# Altium schematic sheet Power.SchDoc
size A4
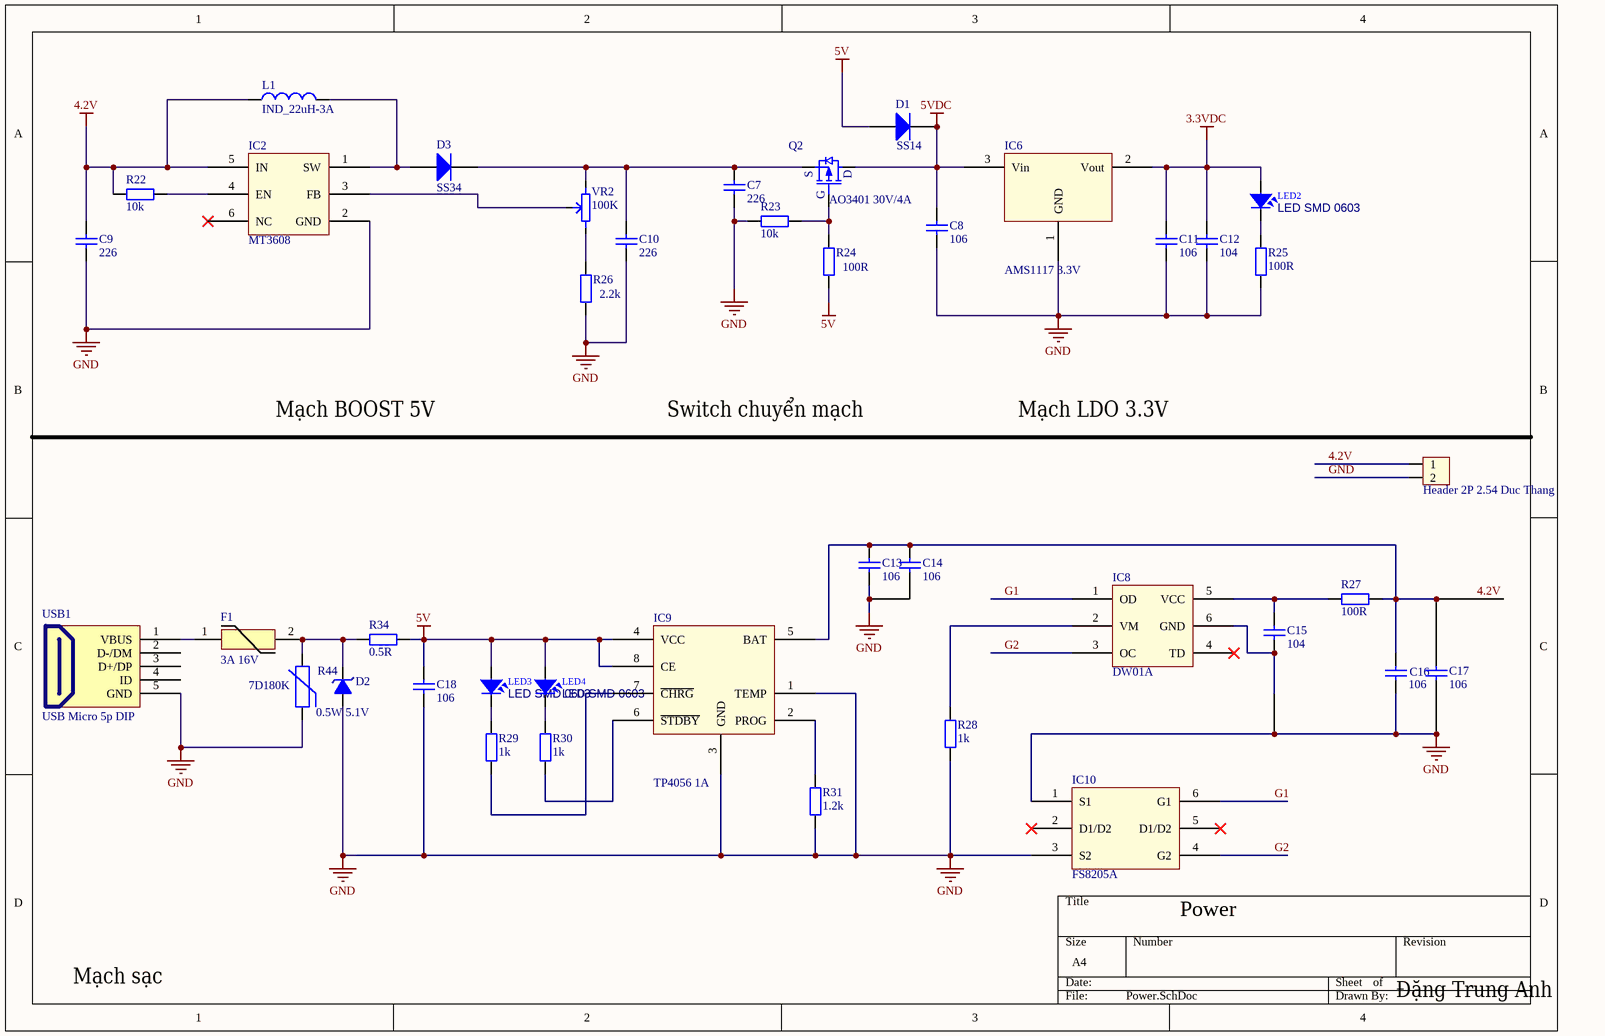
[diagram p0: Power.SchDoc]

## Parts
C7  226  [tu 0603]
C8  106  [tu 0603]
C9  226  [tu 0603]
C10  226  [tu 0603]
C11  106  [tu 0603]
C12  104  [tu 0603]
C13  106  [tu 0603]
C14  106  [tu 0603]
C15  104  [tu 0603]
C16  106  [tu 0603]
C17  106  [tu 0603]
C18  106  [tu 0603]
D1  SS14  [DIODE SMA]
D2  0.5W 5.1V  [DIODE ZENNER SMD SOD80]
D3  SS34  [DIODE SMA]
F1  3A 16V  [FUSE-RUEF250U-2]
H1  Header 2P 2.54 Duc Thang  [XH2.54M-2]
IC2  MT3608  [SOT23-6A]
IC6  AMS1117 3.3V  [SOT223]
IC8  DW01A  [SOT23127P600-8N]
IC9  TP4056 1A  [SOP8]
IC10  FS8205A  [SOT-23-6L]
L1  IND_22uH-3A  [IND_22_10X10_SMD]
LED2  LED SMD 0603  [LED-0603-RED]
LED3  LED SMD 0603  [LED-0603-RED]
LED4  LED SMD 0603  [LED-0603-BLUE]
Q2  AO3401 30V/4A  [SOT23_3]
R22  10k  [tro smd 0603]
R23  10k  [tro smd 0603]
R24  100R  [tro smd 0603]
R25  100R  [tro smd 0603]
R26  2.2k  [tro smd 0603]
R27  100R  [tro smd 0603]
R28  1k  [tro smd 0603]
R29  1k  [tro smd 0603]
R30  1k  [tro smd 0603]
R31  1.2k  [tro smd 0603]
R34  0.5R  [tro smd 0805]
R44  7D180K  [VARISTOR-7D180K]
USB1  USB Micro 5p DIP  [USB Micro 5p DIP]
VR2  100K  [Bien Tro Tam Giac Dung]

## Nets
3.3VDC: C11.1 C12.1 IC6.2(Vout) LED2.A
4.2V: C9.1 C13.1 C14.1 C16.1 C17.1 H1.1 IC2.5(IN) IC9.5(BAT) L1.1 R22.1 R27.1
5V: C18.1 D1.1(A) IC9.4(VCC) IC9.8(CE) LED3.A LED4.A R24.1 R34.2
5VDC: C8.1 D1.2(K) IC6.3(Vin) Q2.3(D)
GND: C7.2 C8.2 C9.2 C10.2 C11.2 C12.2 C13.2 C14.2 C15.2 C16.2 C17.2 C18.2 D2.1(A) H1.2 IC2.2(GND) IC6.1(GND) IC8.6(GND) IC9.1(TEMP) IC9.3(GND) IC10.1(S1) IC10.3(S2) R23.1 R25.1 R26.1 R28.1 R31.1 R44.1 USB1.5(GND)
G1: IC8.1(OD) IC10.6(G1)
G2: IC8.3(OC) IC10.4(G2)
NetC7_1: C7.1 C10.1 D3.2(K) Q2.2(S) VR2.3
NetC15_1: C15.1 IC8.5(VCC) R27.2
NetD2_2: D2.2(K) F1.2 R34.1 R44.2
NetD3_1: D3.1(A) IC2.1(SW) L1.2
NetF1_1: F1.1 USB1.1(VBUS)
NetIC2_3: IC2.3(FB) VR2.2
NetIC2_4: IC2.4(EN) R22.2
NetIC8_2: IC8.2(VM) R28.2
NetIC9_2: IC9.2(PROG) R31.2
NetIC9_6: IC9.6(~{STDBY}) R30.1
NetIC9_7: IC9.7(~{CHRG}) R29.1
NetLED2_K: LED2.K R25.2
NetLED3_K: LED3.K R29.2
NetLED4_K: LED4.K R30.2
NetQ2_1: Q2.1(G) R23.2 R24.2
NetR26_2: R26.2 VR2.1

Not connected (* = marked no-connect by the designer): IC2 6(NC)*; IC8 4(TD)*; IC10 2(D1/D2)* 5(D1/D2)*; USB1 2(D-/DM) 3(D+/DP) 4(ID)

## Notes on the sheet
- Mạch BOOST 5V
- Switch chuyển mạch
- Mạch LDO 3.3V
- (near IC10) Power
- Mạch sạc
- Đặng Trung Anh

## Library data of the parts
C7 C9 C10 = Tu 0603 226 6.3V 10%: Dán; Don_Vi: Con; So_Chan: 2; Ten_Linh_Kien: Tụ 0603 101-0.1nF 10% 50V; Ma_Hang: MH004565; Chung_Loai: Dán; Kieu_Chan: *
C8 C11 C13 C14 C16-C18 = Tu 0603 106 16V 20%: Dán; Don_Vi: Con; So_Chan: 2; Ten_Linh_Kien: Tụ 0603-10uF 20% 16V; Ma_Hang: MH004848; Chung_Loai: Dán; Kieu_Chan: *
C12 C15 = Tu 0603 104 50V 10%: Dán; Don_Vi: Con; So_Chan: 2; Ten_Linh_Kien: Tụ 0603 104-100nF 10% 50V; Ma_Hang: MH004568; Chung_Loai: Dán; Kieu_Chan: *
D1 = Diode SS14 ( 1N5819): Dán; Ma_Hang: MH002211; Don_Vi: Con; Ten_Linh_Kien: Diode SS14 DO214 Schottky 1A 40V ( 1N5819 DO214); Chung_Loai: Dán; Ghi_Chu: *; Kieu_Chan: *
D2 = Diode Zener 5.1V: Dán; Ma_Hang: MH002881; Ten_Linh_Kien: Diode Zener 1/2W 5.1V SMD1206 ZMM5.1; Don_Vi: Con; Kieu_Chan: *; Ghi_Chu: *; Chung_Loai: Dán
D3 = Diode SS34 ( 1N5822 ): Dán; Don_Vi: Con; Ma_Hang: MH002104; Ten_Linh_Kien: Diode SS34 3A 40V SMA ( 1N5822 SS34A); Kieu_Chan: *; Chung_Loai: Dán
F1 = Cau chi tu phuc hoi 3A 16V: FUSE POLYSWITCH RUE SERIES 3A 16V; MPN: RUEF250U-2; CompanyID: VT-00891; Solder: WAVE; Value: 30V/2.5A
H1 = Header 2P 2.54 Duc Thang: Cắm; Ten_Linh_Kien: Header 2P XH2.54-2P Đực Thẳng; Don_Vi: Con; Ma_Hang: MH001283; Chung_Loai: Cắm
IC2 = MT3608_Boost
L1 = IND_22uH-3A-30%-SMD_1: Fixed Inductors MSS1038 SMT Shielded 15 uH 20 % 3.8 A; Manufacturer: Bourns; Manufacturer Part Number: MSS1038-153MLC; Alternate Part Number-1: NA; Case/Package: SMD; Supplier-1: COILCRAFT SAMPLE; Supplier Part Number-1: MSS1038-153MLC
LED2-LED4 = LED SMD 0603: LED 0603 SMD Green 525nm 350mcd 20mA; Manufacturer 1: Kingbright; Manufacturer Part Number 1: APT1608ZGCK; Material: InGaN; Ratings: 200mcd min; 350 mcd typ @ 20mA; Voltage - Forward (Vf) @ 10mA: 3.1V; Viewing Angle: 120°; Lens Style/Size: Rectangle with Flat Top, 1.2mm x 0.8mm; Voltage - Forward (Vf) @ 20mA: 3.3V; SCDType: source; Package / Case: 0603 (1608 metric); Color: Green; Current - Test: 20mA; Manufacturer 2: Kingbright Company LLC; Manufacturer Part Number 2: APT1608-WAP24; Supplier 1: Mouser; Supplier Part Number 1: 604-APT1608ZGCK; ComponentLink1URL: http://www.mouser.com/ds/2/216/APT1608ZGCK-262051.pdf; ComponentLink1Description: http://www.mouser.com/ds/2/216/APT1608ZGCK-262051.pdf; ComponentLink2Description: APT1608-WAP24 Datasheet; ComponentLink2URL: \\SVFI2\PBLShare\Eng\Electrical Engineering\Hardware\Altium\Libraries and Templates\Unreleased Components\Part Number Request 2013-10-02\APT1608-WAP24(Ver.1B).pdf
Q2 = AO3401: MOSFET P-CH 30V 4A SOT23; MPN: AO3415; MFR: Alpha & Omega Semiconductor Inc.; Value: 20V/4A; Solder: SMT
R22 R23 = Tro 0603 5% 10k: Dán; Don_Vi: Con; So_Chan: 2; Ten_Linh_Kien: Trở 0603 5% 10k; Ma_Hang: MH006316; Chung_Loai: Dán; Kieu_Chan: *
R24 R25 R27 = Tro 0603 5% 100R: Dán; Don_Vi: Con; So_Chan: 2; Ten_Linh_Kien: Trở 0603 5% 100R; Ma_Hang: MH006315; Chung_Loai: Dán; Kieu_Chan: *
R26 = Tro 0603 5% 2.2k: Dán; Don_Vi: Con; So_Chan: 2; Ten_Linh_Kien: Trở 0603 5% 2.2k; Ma_Hang: MH006321; Chung_Loai: Dán; Kieu_Chan: *
R28-R30 = Tro 0603 5% 1k: Dán; Don_Vi: Con; So_Chan: 2; Ten_Linh_Kien: Trở 0603 5% 1k; Ma_Hang: MH006319; Chung_Loai: Dán; Kieu_Chan: *
R31 = Tro 0603 1% 1.2k: Dán; Don_Vi: Con; So_Chan: 2; Ten_Linh_Kien: Trở 0603 1% 0R; Ma_Hang: MH005792; Chung_Loai: Dán; Kieu_Chan: *
R34 = Tro 0805 5% 0.5R: Dán; Don_Vi: Con; So_Chan: 2; Ten_Linh_Kien: Trở 0805 5% 0.5R; Ma_Hang: MH005303; Chung_Loai: Dán; Kieu_Chan: *
R44 = Varistor 7D180K: VARISTOR 7V 18A DISC 7MM; MPN: V47ZA1P; Solder: WAVE; Value: 47V/250A; CompanyID: VT-00888; Category: VARISTOR
USB1 = USB Micro 5p DIP: USB Type B; Ten: MicroUSB MK5P DIP; Ma_Hang: MH005145
VR2 = Bien tro tam giac 100K Dung: Cắm; Don_Vi: Con; Ten_Linh_Kien: Biến Trở Tam Giác 104-100K RM065; Ma_Hang: MH003711; Chung_Loai: Cắm; Ghi_Chu: *; Kieu_Chan: *